# Altium schematic sheet USB.SCHDOC
size 297 x 209 mm; SheetNumber: 4; SheetTotal: 5; DocumentName: USB.SCHDOC
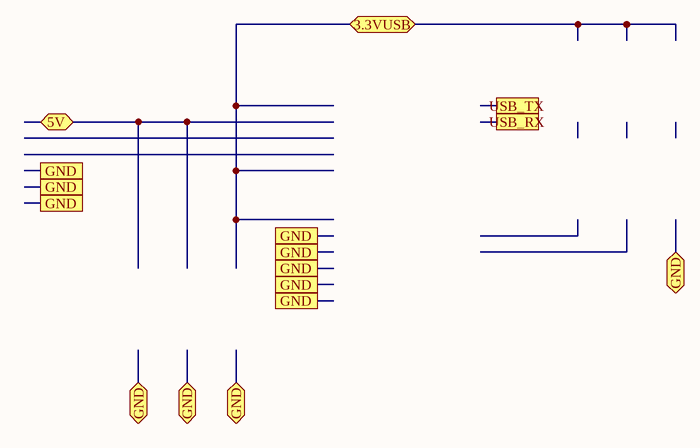
[diagram p0: USB.SCHDOC]

## Ports
3.3VUSB (bidir), 5V (bidir), GND, USB_RX, USB_TX

## Notes on the sheet
- A
- B
- C
- D
- 1
- 2
- 3
- Title
- 4
- Size
- A4
- Number
- Rev
- Date
- Filename
- Drawn by
- Sheet
- of